# EAGLE design Un_RF_old (EAGLE 6.2)
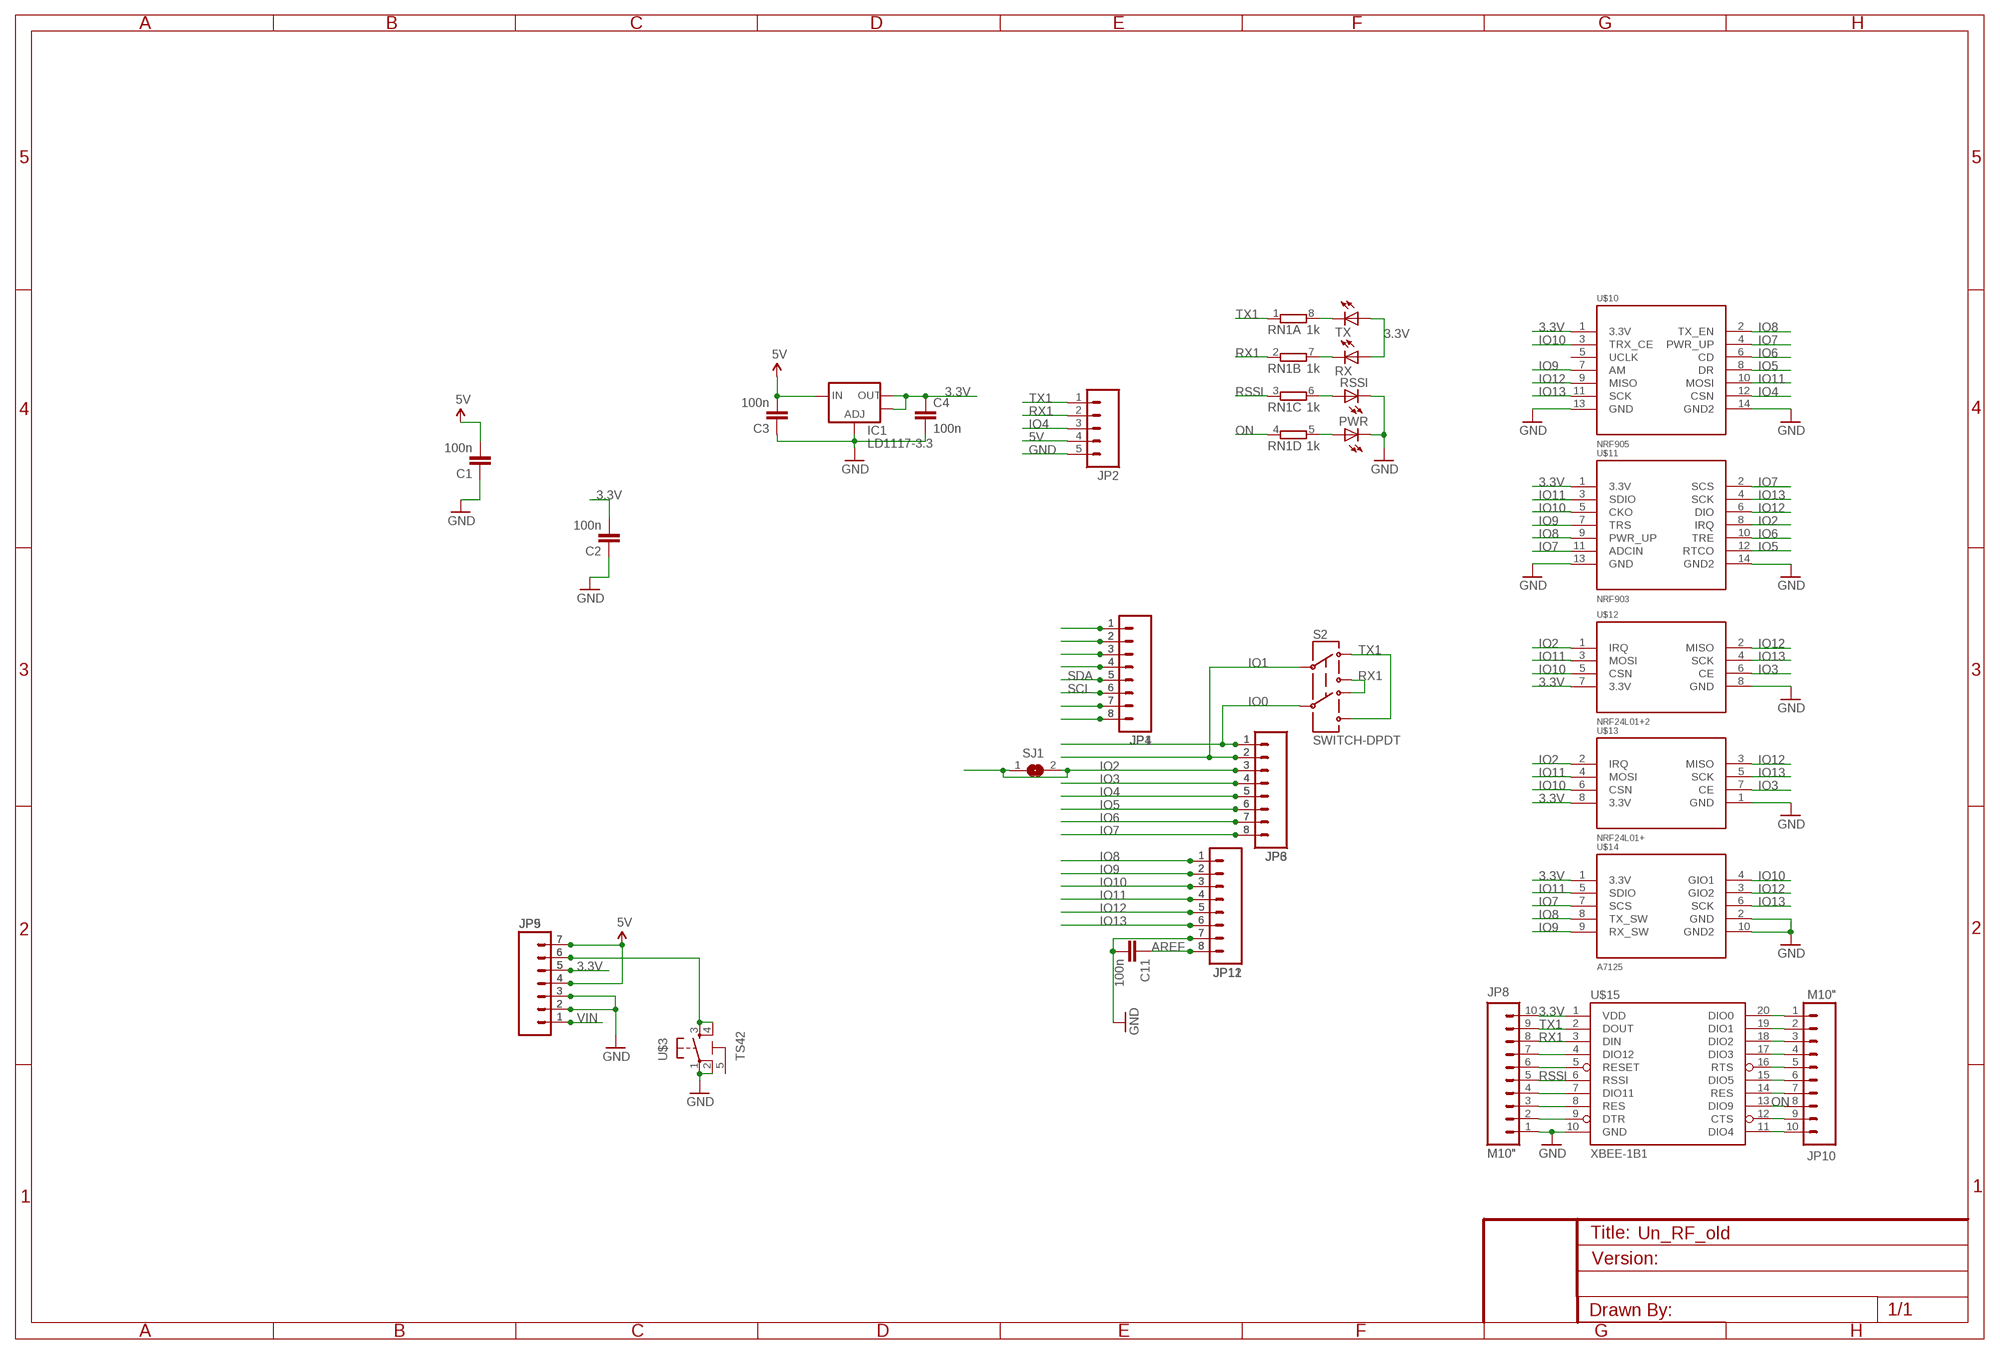
[diagram p0: schematic, sheet 1]

## Parts
C1  100n  CAP0603-CAP  [0603-CAP]
C2  100n  CAP0603-CAP  [0603-CAP]
C3  100n  CAP0603-CAP  [0603-CAP]
C4  100n  CAP0603-CAP  [0603-CAP]
C11  100n  CAP0603-CAP  [0603-CAP]
IC1  LD1117-3.3  V_REG_LM1117SOT223  [SOT223]
JP1  M081X08  [1X08]
JP2  M05PTH  [1X05]
JP3  M08  [1X08]
JP4  M081X08  [1X08]
JP5  M07  [1X07]
JP6  M08  [1X08]
JP8  M10"  [1X10]
JP9  M07  [1X07]
JP10  M10"  [1X10]
JP11  M081X08  [1X08]
JP12  M081X08  [1X08]
PWR  LED0805  [LED-0805]
RN1  1k  4R-NCAY16  [CAY16]
RSSI  LED0805  [LED-0805]
RX  LED0805  [LED-0805]
S2  SWITCH-DPDT  [SWITCH-P2]
SJ1  SJ  [SJ]
TX  LED0805  [LED-0805]
U$3  TS42  [TS42]
U$10  NRF905  [2X7]
U$11  NRF903  [2X7]
U$12  NRF24L01+2  [2X4]
U$13  NRF24L01+  [1X08]
U$14  A7125  [1X10-2MM]
U$15  XBEE-1B1  [XBEE-1]

## Nets
3.3V: C2.2 C4.1 IC1.2(OUT) IC1.4(OUT) JP5.5 JP8.10 JP9.5 RX.1(A) TX.1(A) U$10.1(3.3V) U$11.1(3.3V) U$12.7(3.3V) U$13.8(3.3V) U$14.1(3.3V) U$15.1(VDD)
5V: C1.2 C3.2 IC1.3(IN) JP2.4 JP5.4 JP5.7 JP9.4 JP9.7
A0: JP1.1 JP4.1
AREF: C11.1 JP11.8 JP12.8
GND: C1.1 C2.1 C3.1 C4.2 C11.2 IC1.1(ADJ) JP2.5 JP5.2 JP5.3 JP8.1 JP9.2 JP9.3 JP11.7 JP12.7 PWR.2(C) RSSI.2(C) U$3.1 U$3.2 U$10.13(GND) U$10.14(GND2) U$11.13(GND) U$11.14(GND2) U$12.8(GND) U$13.1(GND) U$14.2(GND) U$14.10(GND2) U$15.10(GND)
IO0: JP3.1 JP6.1 S2.5
IO1: JP3.2 JP6.2 S2.2
IO2: JP3.3 JP6.3 SJ1.1 SJ1.2 U$11.8(IRQ) U$12.1(IRQ) U$13.2(IRQ)
IO3: JP3.4 JP6.4 U$12.6(CE) U$13.7(CE)
IO4: JP2.3 JP3.5 JP6.5 U$10.12(CSN)
IO5: JP3.6 JP6.6 U$10.8(DR) U$11.12(RTCO)
IO6: JP3.7 JP6.7 U$10.6(CD) U$11.10(TRE)
IO7: JP3.8 JP6.8 U$10.4(PWR_UP) U$11.2(SCS) U$11.11(ADCIN) U$14.7(SCS)
IO8: JP11.1 JP12.1 U$10.2(TX_EN) U$11.9(PWR_UP) U$14.8(TX_SW)
IO9: JP11.2 JP12.2 U$10.7(AM) U$11.7(TRS) U$14.9(RX_SW)
IO10: JP11.3 JP12.3 U$10.3(TRX_CE) U$11.5(CKO) U$12.5(CSN) U$13.6(CSN) U$14.4(GIO1)
IO11: JP11.4 JP12.4 U$10.10(MOSI) U$11.3(SDIO) U$12.3(MOSI) U$13.4(MOSI) U$14.5(SDIO)
IO12: JP11.5 JP12.5 U$10.9(MISO) U$11.6(DIO) U$12.2(MISO) U$13.3(MISO) U$14.3(GIO2)
IO13: JP11.6 JP12.6 U$10.11(SCK) U$11.4(SCK) U$12.4(SCK) U$13.5(SCK) U$14.6(SCK)
N$3: RN1.8 TX.2(C)
N$4: RN1.7 RX.2(C)
N$5: RN1.6 RSSI.1(A)
N$6: PWR.1(A) RN1.5
N$11: JP10.1 U$15.20(DIO0)
N$12: JP1.7 JP4.7
N$13: JP1.8 JP4.8
N$21: JP10.2 U$15.19(DIO1)
N$22: JP10.3 U$15.18(DIO2)
N$30: JP10.4 U$15.17(DIO3)
N$31: JP1.2 JP4.2
N$32: JP1.3 JP4.3
N$33: JP1.4 JP4.4
N$35: JP10.5 U$15.16(RTS)
N$36: JP10.6 U$15.15(DIO5)
N$37: JP10.7 U$15.14(RES)
N$38: JP5.6 JP9.6 U$3.3 U$3.4
N$42: JP10.9 U$15.12(CTS)
N$43: JP10.10 U$15.11(DIO4)
N$45: JP8.2 U$15.9(DTR)
N$46: JP8.3 U$15.8(RES)
N$47: JP8.4 U$15.7(DIO11)
N$49: JP8.6 U$15.5(RESET)
N$50: JP8.7 U$15.4(DIO12)
ON: JP10.8 RN1.4 U$15.13(DIO9)
RSSI: JP8.5 RN1.3 U$15.6(RSSI)
RX1: JP2.2 JP8.8 RN1.2 S2.3 S2.4 U$15.3(DIN)
SCL: JP1.6 JP4.6
SDA: JP1.5 JP4.5
TX1: JP2.1 JP8.9 RN1.1 S2.1 S2.6 U$15.2(DOUT)
VIN: JP5.1 JP9.1
Unconnected: U$3.5 U$10.5(UCLK)

## Library data of the parts
C1-C4 C11 = 1SparkFun:CAP: Capacitor Standard 0603 ceramic capacitor, and 0.1" leaded capacitor.
IC1 = 2SparkFun:V_REG_LM1117: Voltage Regulator LM1117 Standard adjustable voltage regulator but in SMD form. Spark Fun Electronics SKU : COM-00595
JP1 JP4 JP11 JP12 = 2SparkFun:M08: Header 8 Standard 8-pin 0.1" header. Use with straight break away headers (SKU : PRT-00116), right angle break away headers (PRT-00553), swiss pins (PRT-00743), machine pins (PRT-00117), and female headers (PRT-00115).
JP2 = 2SparkFun:M05: Header 5 Standard 5-pin 0.1" header. Use with straight break away headers (SKU : PRT-00116), right angle break away headers (PRT-00553), swiss pins (PRT-00743), machine pins (PRT-00117), and female headers (PRT-00115). Molex polarized connector foot print use with SKU : PRT-08230 with associated crimp pins and housings.
JP3 JP6 = 1SparkFun:M08: Header 8 Standard 8-pin 0.1" header. Use with straight break away headers (SKU : PRT-00116), right angle break away headers (PRT-00553), swiss pins (PRT-00743), machine pins (PRT-00117), and female headers (PRT-00115).
JP5 JP9 = 2SparkFun:M07: Header 7 Standard 7-pin 0.1" header. Use with straight break away headers (SKU : PRT-00116), right angle break away headers (PRT-00553), swiss pins (PRT-00743), machine pins (PRT-00117), and female headers (PRT-00115). NOTES ON THE VARIANTS LOCK and LOCK_LONGPADS... This footprint was designed to help hold the alignment of a through-hole component (i.e. 7-pin header) while soldering it into place. You may notice that each hole has been shifted either up or down by 0.005 of an inch from it's more standard position (which is usually a perfectly straight line). This slight alteration caused the pins (the squares in the middle) to touch the edges of the holes. Because they are alternating, it causes a "brace" to hold the header in place. 0.005 has proven to be the perfect amount of "off-center" position when using our standard breakaway headers. Although looks a little odd when you look at the bare footprint, once you have a header in there, the alteration is very hard to notice. Also, if you push a header all the way into place, it is covered up entirely on the bottom side. This idea of altering the position of holes to aid alignment will be further integrated into the Sparkfun Library for other footprints. It can help hold any component with 3 or more connection pins.
JP8 JP10 = 2SparkFun:M10: Header 10 Standard 10-pin 0.1" header. Use with straight break away headers (SKU : PRT-00116), right angle break away headers (PRT-00553), swiss pins (PRT-00743), machine pins (PRT-00117), and female headers (PRT-00115).
PWR RSSI RX TX = 1SparkFun:LED: LEDs Standard schematic elements and footprints for 5mm, 3mm, 1206, and 0603 sized LEDs. 5mm - Spark Fun Electronics SKU : COM-00529 (and others)
RN1 = resistor-dil:4R-N: Array Chip Resistor Source: RS Component / Phycomp; OC_FARNELL: unknown; OC_NEWARK: unknown
S2 = 2SparkFun:SWITCH-DPDT: DPDT Version of the COM-00597
SJ1 = jumper:SJ: SMD solder JUMPER
U$3 = 2SparkFun:TS42
U$10 = 2SparkFun:NRF905
U$11 = 2SparkFun:NRF903
U$12 U$13 = 2SparkFun:NRF24L01+
U$14 = 2SparkFun:A7125
U$15 = 2SparkFun:XBEE-1

## Net classes
0 default: width 0.254 mm, clearance 0.508 mm
1 power: width 0.61 mm, drill 0.61 mm, clearance 0.254 mm
2 gnd: width 0.305 mm, drill 0.559 mm, clearance 0.254 mm
3 usbvcc: width 0.508 mm, drill 0.61 mm, clearance 0.254 mm
4 aref: width 0.406 mm, drill 0.61 mm, clearance 0.254 mm

## Board
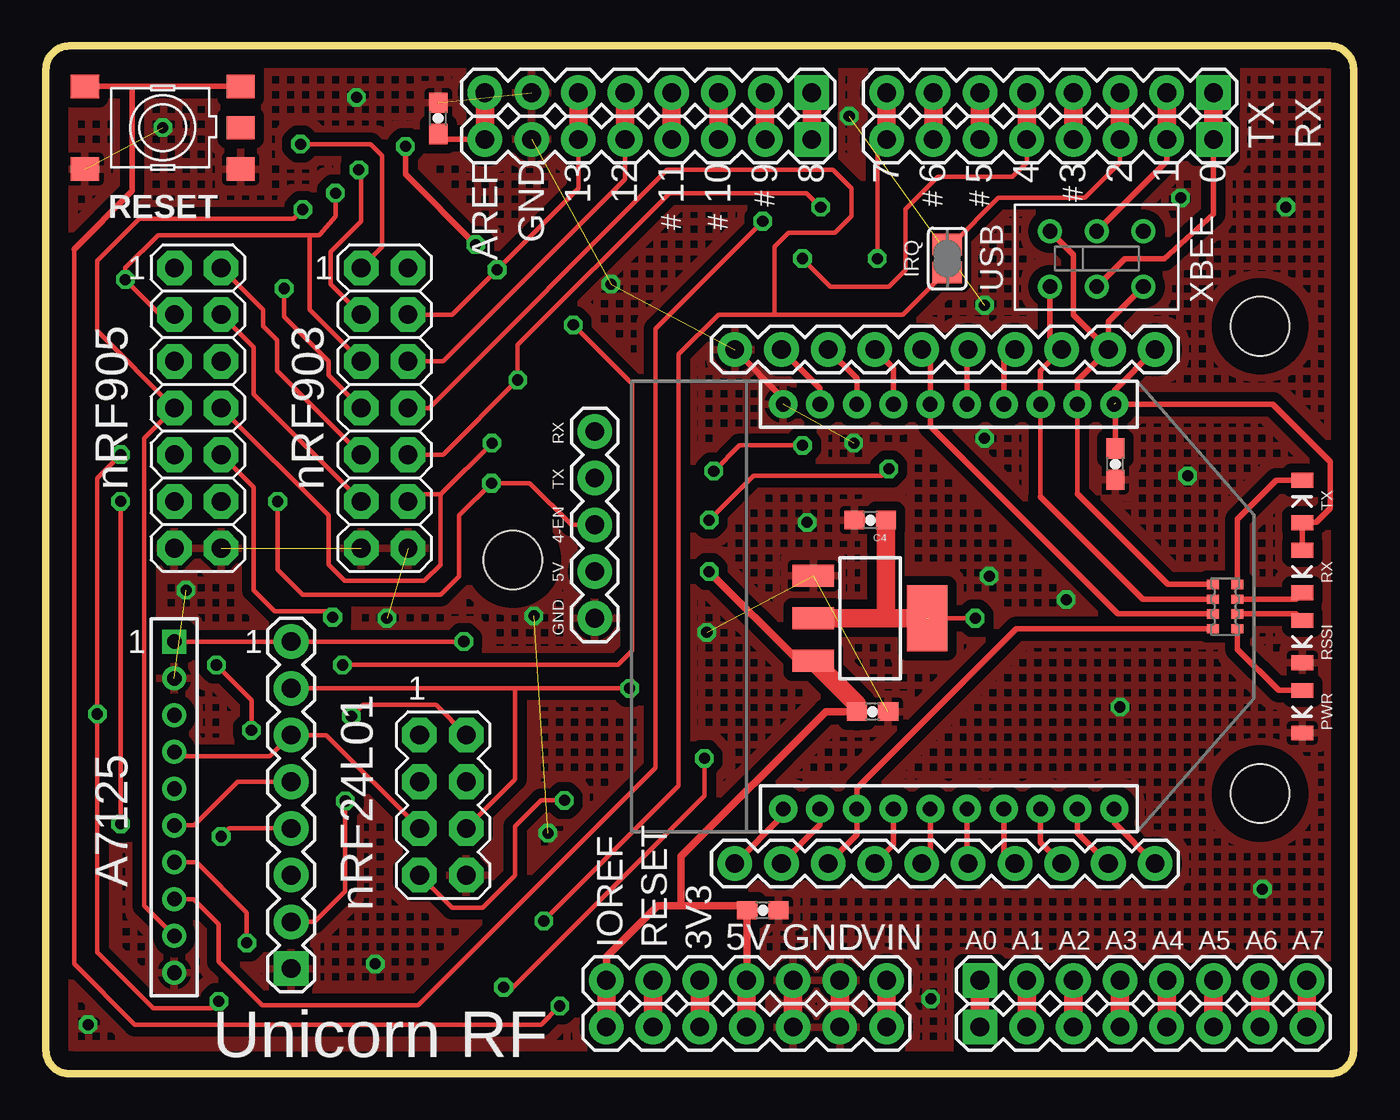
[diagram p1: board, top side]
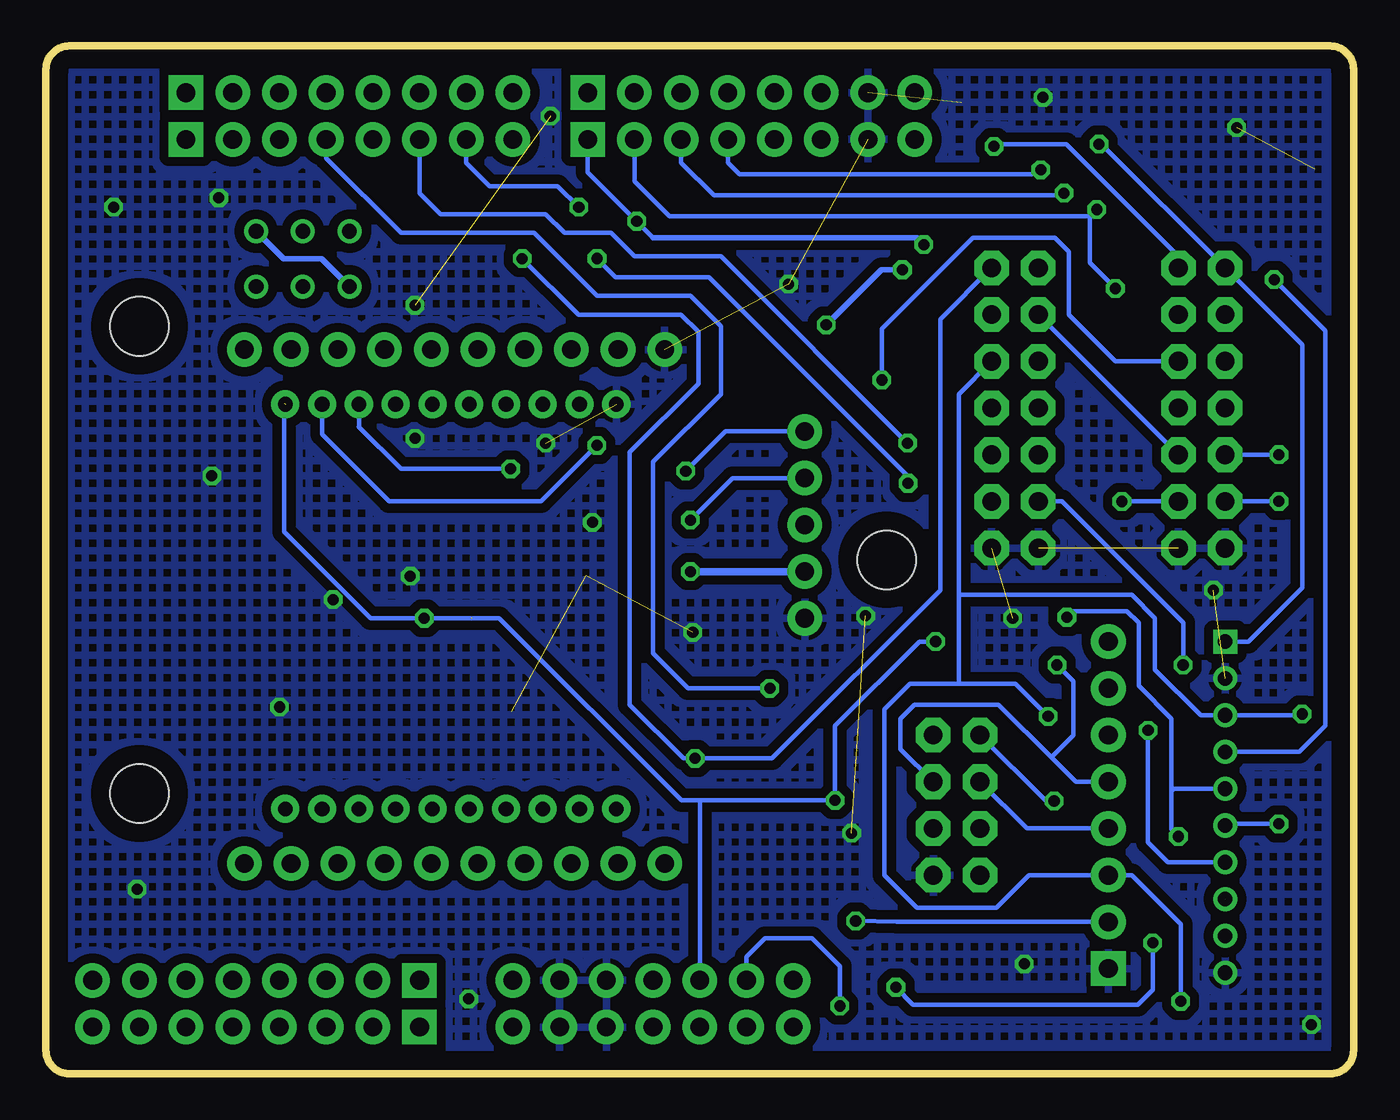
[diagram p2: board, bottom side, seen from below]

Size 71.12 x 55.88 mm. Coordinates in mm from the lower left corner, seen from the top.
Outline: 1.27,0 69.85,0 arc90 71.12,1.27 71.12,54.61 arc90 69.85,55.88 1.27,55.88 arc90 0,54.61 0,1.27 arc90 1.27,0
Copper layers (1*16): Top 0.035mm / dielectric 1.5mm / Bottom 0.035mm
Design rules: minimum track width 10mil, minimum drill 24mil, track to track 10mil, track to pad 10mil, pad to pad 10mil, via to via 10mil, smd to smd 10mil, copper to edge 40mil, drill to drill 10mil, minimum pad ring 10mil, minimum via ring 8mil, stop-mask expansion 4mil, vias tented up to drill 0mil, thermal gap 10mil
Holes 3.2 mm at 66.04,40.64 66.04,15.24 25.4,27.94

### Footprints (pad centres in the part's own frame; a part is rotated, then mirrored left to right if it is on the bottom)
0603-CAP = smd 1.1 x 1: 1 -0.85,0; 2 0.85,0
SOT223 = smd 1.219 x 2.235: 1 -2.311,-3.099; 2 0,-3.099; 3 2.311,-3.099 | smd 3.6 x 2.2: 4 0,3.099
1X08 = drill 1.016 pad 1.88 square: 1 0,0 | drill 1.016 pad 1.88: 2 2.54,0; 3 5.08,0; 4 7.62,0; 5 10.16,0; 6 12.7,0; 7 15.24,0; 8 17.78,0
1X05 = drill 1.016 pad 1.88: 1 0,0; 2 2.54,0; 3 5.08,0; 4 7.62,0; 5 10.16,0
1X07 = drill 1.016 pad 1.88: 1 0,0; 2 2.54,0; 3 5.08,0; 4 7.62,0; 5 10.16,0; 6 12.7,0; 7 15.24,0
1X10 = drill 1.016 pad 1.88: 1 0,0; 2 2.54,0; 3 5.08,0; 4 7.62,0; 5 10.16,0; 6 12.7,0; 7 15.24,0; 8 17.78,0; 9 20.32,0; 10 22.86,0
LED-0805 = smd 0.8 x 1.2: 1 -1.154,0; 2 1.154,0
CAY16 = smd 0.5 x 0.65: 1 -1.2,-0.675; 2 -0.4,-0.675; 3 0.4,-0.675; 4 1.2,-0.675; 5 1.2,0.675; 6 0.4,0.675; 7 -0.4,0.675; 8 -1.2,0.675
SWITCH-P2 = drill 0.8: 1 0,3.01; 2 2.54,3.01; 3 5.08,3.01; 4 0,0; 5 2.54,0; 6 5.08,0
SJ = smd 1.168 x 1.6: 1 -0.762,0; 2 0.762,0
TS42 = smd 1.524 x 1.27: 1 -4.229,2.25; 2 4.229,2.25; 3 -4.229,-2.25; 4 4.229,-2.25; 5 -4.229,-0.002
2X7 = drill 1.016 pad 1.88 octagon: 1 0,0; 2 0,2.54; 3 2.54,0; 4 2.54,2.54; 5 5.08,0; 6 5.08,2.54; 7 7.62,0; 8 7.62,2.54; 9 10.16,0; 10 10.16,2.54; 11 12.7,0; 12 12.7,2.54; 13 15.24,0; 14 15.24,2.54
2X4 = drill 1.016 pad 1.88 octagon: 1 -3.81,-1.27; 2 -3.81,1.27; 3 -1.27,-1.27; 4 -1.27,1.27; 5 1.27,-1.27; 6 1.27,1.27; 7 3.81,-1.27; 8 3.81,1.27
1X10-2MM = drill 0.8 square: 1 0,0 | drill 0.8: 2 2,0; 3 4,0; 4 6,0; 5 8,0; 6 10,0; 7 12,0; 8 14,0; 9 16,0; 10 18,0
XBEE-1 = drill 0.8 pad 1.524: 1 -11,20; 2 -11,18; 3 -11,16; 4 -11,14; 5 -11,12; 6 -11,10; 7 -11,8; 8 -11,6; 9 -11,4; 10 -11,2; 11 11,2; 12 11,4; 13 11,6; 14 11,8; 15 11,10; 16 11,12; 17 11,14; 18 11,16; 19 11,18; 20 11,20

### Placement (x,y rotation side)
C1  38.99,8.89 180 top
C2  58.17,33.15 90 top
C3  44.96,19.68 180 top
C4  44.83,30.1 180 top
C11  21.34,51.94 90 top
IC1  44.83,24.77 270 top
JP1  50.8,5.08 0 top
JP2  29.84,34.92 270 top
JP3  63.5,53.34 180 top
JP4  50.8,2.54 0 top
JP5  45.72,2.54 180 top
JP6  63.5,50.8 180 top
JP8  37.47,39.37 0 top
JP9  45.72,5.08 180 top
JP10  60.33,11.43 180 top
JP11  41.66,50.8 180 top
JP12  41.66,53.34 180 top
PWR  68.33,19.68 270 top
RN1  64.14,25.4 270 top
RSSI  68.33,23.5 270 top
RX  68.33,27.3 270 top
S2  54.61,42.8 0 top
SJ1  49.02,44.32 270 top
TX  68.33,31.11 90 top
U$3  6.35,51.44 180 top
U$10  6.98,43.81 270 top
U$11  17.14,43.81 270 top
U$12  21.59,14.61 270 top
U$13  13.33,5.71 90 top
U$14  6.98,23.5 270 top
U$15  38.1,25.4 270 top

### Tracks (layer width: path | path; a pad name or v marks a point on that pad's centre or on a via)
3.3V  (via drill 0.6, 0.61)  (2 unrouted)
  Top 0.254: U$14.1 U$13.8 v22.73,23.5 | U$11.1 18.29,44.96 18.29,49.91 17.65,50.55 v13.84,50.55 | U$12.7 22.1,9.02 23.75,9.02 25.53,10.79 25.53,13.46 26.92,14.86 v28.19,14.86 | v50.55,24.77 48.01,24.77
  Top 0.305: U$15.1 58.1,37.15 JP8.10 | U$15.1 66.72,36.4 69.85,33.27 69.85,30.73 69.09,29.97 68.34,29.97 TX.1 | TX.1 68.7,29.96 | TX.1 RX.1 | C2.2 58.17,36.33 U$15.1
  Top 1.016: JP5.5 JP9.5 | IC1.2 45.97,24.77 | 45.97,24.77 IC1.4 | C4.1 45.68,25.06 45.97,24.77
  Bottom 0.254: U$15.1 | v22.73,23.5 23.62,23.5 28.19,18.92 v28.19,14.86 35.56,14.86 | v13.84,50.55 13.72,50.55 U$10.1 2.79,39.62 2.79,27.56 2.79,27.3 2.79,26.42 5.72,23.5 U$14.1 | 35.56,14.86 36.56,14.86 46.47,24.77 v50.55,24.77 53.47,24.77 58.17,29.46 58.17,36.45 | JP9.5 35.56,14.86
5V  (via drill 0.6)
  Top 0.254: JP9.4 38.14,5.12 | 37.82,9.14 38.02,8.94 C1.2 37.89,9.14
  Top 0.406: v36.07,27.3 40.92,22.45 IC1.3 | C3.2 42.42,19.68 34.54,11.81 34.54,9.14 | JP9.7 30.48,6.35 33.27,9.14 34.54,9.14 | 38.14,5.12 C1.2 | 37.82,9.14 34.54,9.14
  Top 1.016: JP5.7 JP9.7 | JP5.4 JP9.4 | C3.2 44.11,20.08 IC1.3
  Bottom 0.406: JP2.4 v36.07,27.3
A0
  Top 1.016: JP1.1 JP4.1
AREF
  Top 0.305: JP11.8 21.63,50.8 C11.1
  Top 1.016: JP12.8 JP11.8
GND  (via drill 0.6)  (12 unrouted)
  Top 0.254: 68.33,22.35 RSSI.2
  Top 0.305: U$15.10 40.1,36.73 JP8.1
  Top 1.016: JP5.2 JP9.2 | JP5.3 JP9.3
  other vias: 6.35,51.44 16.89,53.09 51.05,41.78 51.05,34.54 55.5,25.78 51.31,27.05 62.1,32.51 58.42,19.94 66.17,10.03 17.91,5.97 48.13,4.06 26.54,24.89 18.54,24.77 67.44,47.12 7.62,26.29 2.29,2.67 30.73,42.93 35.94,24 43.69,52.07 27.31,13.08 43.94,34.29 41.4,29.97 61.72,47.62
  pour Bottom (hatched): 0,55.88 71.12,55.88 71.12,0 0,0
  pour Top (hatched): 0,55.88 71.12,55.88 71.12,0 0,0
IO0
  Top 0.305: S2.5 58.67,44.32 60.83,44.32 63.5,46.74 JP6.1
  Top 1.016: JP3.1 JP6.1
IO1
  Top 0.305: JP6.2 60.96,49.62 S2.2
  Top 1.016: JP3.2 JP6.2
IO2  (via drill 0.61)
  Top 0.254: v16.28,14.83 16.28,9.93 14.61,8.26 U$13.2 | v27.08,8.31 34.42,15.65 34.42,39.12 36.58,41.27 39.62,41.27 | JP6.3 58.42,49.53 56.52,47.62 51.82,47.62 49.28,45.09 SJ1.1 SJ1.2 48.89,43.56 46.61,41.27 39.62,41.27 | 39.62,41.27 39.62,44.96 40.39,45.72 42.93,45.72 43.81,46.61 43.81,48.13 42.8,49.15 33.78,49.15 20.83,36.2 U$11.8
  Top 1.016: JP3.3 JP6.3
  Bottom 0.254: U$13.2 24.87,8.26 v27.08,8.31 | U$12.1 16.74,14.83 v16.28,14.83
IO3  (via drill 0.6)
  Top 0.254: U$13.7 25.53,20.95 | 25.53,20.95 v31.75,20.95 | U$12.6 25.53,16 25.53,20.95
  Top 1.016: JP3.4 JP6.4
  Bottom 0.254: JP6.4 55.88,49.78 51.82,45.72 44.58,45.72 41.15,42.29 36.07,42.29 34.42,40.64 34.42,36.96 38.1,33.27 38.1,22.86 36.19,20.95 v31.75,20.95
IO4  (via drill 0.61)
  Top 0.254: v12.6,31.11 12.6,27.41 13.97,26.04 21.46,26.04 22.48,27.05 22.48,30.35 v24.23,32.11 26.31,32.11 28.58,29.84 JP2.3 | v41.15,44.32 42.67,42.8 45.85,42.8 46.74,43.69 46.74,46.99 48.51,48.77 52.58,48.77 53.34,49.53 JP6.5
  Top 1.016: JP3.5 JP6.5
  Bottom 0.254: v12.6,31.11 U$10.12 | v24.23,32.11 24.23,32.49 35.05,43.31 40.13,43.31 v41.15,44.32
IO5  (via drill 0.6)
  Top 0.254: U$10.8 15.37,30.35 15.37,27.69 16.26,26.8 20.57,26.8 21.46,27.69 21.46,31.5 | 21.46,31.5 v24.26,34.29 | U$11.12 20.07,31.5 21.46,31.5
  Top 1.016: JP3.6 JP6.6
  Bottom 0.254: JP6.6 50.8,47.88 49.66,46.74 43.94,46.74 42.93,45.72 40.39,45.72 39.12,44.45 34.42,44.45 v24.26,34.29
IO6  (via drill 0.6, 0.61)
  Top 0.254: v42.14,47.12 41.38,47.88 34.42,47.88 34.29,47.88 33.91,47.88 25.65,39.62 v25.65,37.72 21.59,33.66 U$11.10
  Top 1.016: JP3.7 JP6.7
  Bottom 0.254: U$10.6 12.95,38.73 15.49,41.27 15.49,44.7 16.26,45.47 20.7,45.47 25.65,40.51 v25.65,37.72 | JP6.7 48.26,49.53 46.99,48.26 43.28,48.26 v42.14,47.12
IO7  (via drill 0.6, 0.61)
  Top 0.254: U$10.4 11.3,39.5 11.3,36.96 U$11.11 | U$14.7 8.19,11.49 10.92,8.76 v10.92,7.11 | v11.18,18.67 11.18,20.32 v9.27,22.23 | v24.89,4.7 25.4,4.7 35.81,15.11 v35.81,17.14 | JP6.8 45.21,50.29 v45.21,44.32
  Top 1.016: JP3.8 JP6.8
  Bottom 0.254: U$14.7 10.11,11.51 11.18,12.57 v11.18,18.67 | v10.92,7.11 10.92,4.57 11.73,3.76 23.95,3.76 v24.89,4.7 | v9.27,22.23 9.27,24.51 15.88,31.11 U$11.11 | U$11.2 22.48,41.02 22.48,26.29 31.62,17.14 v35.81,17.14 36.45,17.14 39.37,20.07 39.37,33.78 35.64,37.52 35.64,40.34 36.58,41.27 42.16,41.27 v45.21,44.32
IO8  (via drill 0.6, 0.61)  (1 unrouted)
  Top 0.254: v38.99,46.35 33.15,40.51 33.15,16.64 20.24,3.73 11.76,3.73 9.4,6.1 9.4,8.13 8.03,9.5 U$14.8 | U$11.9 12.57,38.23 12.57,39.88 11.81,40.64 11.81,41.53 U$10.2
  Top 0.305: v19.56,50.42 19.56,48.9 v23.37,45.09
  Top 1.016: JP12.1 JP11.1
  Bottom 0.254: JP11.1 41.66,49.02 v38.99,46.35 38.1,45.47 | U$10.2 9.53,44.45 15.62,50.55 19.43,50.55 v19.56,50.42
  Bottom 0.305: 38.1,45.47 23.75,45.47 v23.37,45.09
IO9  (via drill 0.6, 0.61)
  Top 0.254: v12.95,42.7 12.95,41.15 15.37,38.73 15.37,37.97 U$11.7 | U$14.9 5.33,9.15 5.33,34.54 U$10.7 2.79,40.39 2.79,44.2 5.08,46.48 13.46,46.48 v13.97,46.99
  Top 1.016: JP11.2 JP12.2
  Bottom 0.254: JP11.2 39.12,48.51 37.21,46.61 14.35,46.61 | 14.35,46.61 v13.97,46.99 | v12.95,42.7 14.35,44.09 14.35,46.61
IO10  (via drill 0.6)
  Top 0.254: U$12.5 15.24,18.41 U$13.6 13.23,18.34 12.17,17.27 7.21,17.27 U$14.4 | U$11.5 14.35,41.53 14.35,45.59 | 14.86,45.59 14.91,45.66 | 14.91,45.66 15.75,46.61 v15.75,47.88 | 14.35,45.59 6.1,45.59 4.32,43.81 v4.32,43.18 6.22,41.27 U$10.3 | 14.35,45.59 14.85,45.59 14.91,45.66
  Top 1.016: JP12.3 JP11.3
  Bottom 0.254: JP11.3 36.58,49.53 34.8,47.75 15.88,47.75 v15.75,47.88 | U$14.4 2.95,17.5 1.52,18.92 1.52,40.39 v4.32,43.18
IO11  (via drill 0.6, 0.61)
  Top 0.254: U$13.4 9.96,13.34 v9.53,12.9 | U$10.10 11.3,31.88 11.3,26.29 12.45,25.15 15.27,25.15 v15.6,24.82 | U$11.3 15.49,42.93 15.49,44.7 17.14,46.35 17.14,49.02 v17.02,49.15
  Top 1.016: JP11.4 JP12.4
  Bottom 0.254: U$11.3 U$10.10 | U$14.5 9.78,15.49 9.91,15.37 | U$13.4 17.78,13.34 U$12.3 | 9.91,15.37 9.91,19.3 11.68,21.08 11.68,24.51 12.32,25.15 15.27,25.15 v15.6,24.82 | 9.91,15.37 9.91,13.28 v9.53,12.9 | JP11.4 34.04,49.53 33.4,48.9 17.53,48.9 v17.02,49.15
IO12  (via drill 0.6, 0.61)
  Top 0.254: U$12.2 21.21,20.07 17.25,20.07 v16.61,19.43 | v4.06,33.66 2.79,32.38 v2.79,19.56 2.79,6.6 5.84,3.56 9.02,3.56 v9.4,3.94 | JP11.5 31.5,48.64 21.59,38.73 U$11.6
  Top 1.016: JP12.5 JP11.5
  Bottom 0.254: v9.4,3.94 9.4,8.13 12.06,10.79 U$13.3 17.65,10.79 19.43,9.02 23.75,9.02 25.53,10.79 25.53,19.81 24.13,21.21 21.46,21.21 | 21.46,21.21 18.39,21.21 v16.61,19.43 | U$11.6 21.46,36.96 21.46,26.04 | 21.46,26.04 21.46,21.21 | 21.46,26.04 12.06,26.04 10.8,24.77 10.8,21.97 8.32,19.5 U$14.3 2.86,19.5 v2.79,19.56 | U$10.9 v4.06,33.66
IO13  (via drill 0.6, 0.61)
  Top 0.254: v16.13,22.23 31.11,22.23 31.88,22.99 31.88,37.52 v28.68,40.72 | U$13.5 10.41,15.88 8.05,13.51 6.98,13.51 U$14.6 | v4.06,31.11 v4.06,13.59 | JP11.6 28.96,48.13 v24.54,43.71 22.1,41.27 U$11.4
  Top 1.016: JP11.6 JP12.6
  Bottom 0.254: U$13.5 15.11,15.88 16.38,17.14 | 16.38,17.14 19.3,20.07 23.88,20.07 24.64,19.3 24.64,17.65 U$12.4 | v16.13,22.23 15.24,21.34 15.24,18.41 16.38,17.27 16.38,17.14 | U$10.11 v4.06,31.11 | v4.06,13.59 6.89,13.59 U$14.6
  Bottom 0.305: v24.54,43.71 25.68,43.71 v28.68,40.72
N$3
  Top 0.305: 67.96,32.27 TX.2 68.31,32.26 66.93,32.26 64.81,30.14 RN1.8
N$4
  Top 0.305: RN1.7 67.97,25.8 RX.2
N$5
  Top 0.305: RN1.6 67.97,25 RSSI.1
N$6
  Top 0.305: PWR.1 67.04,20.84 64.81,23.07 RN1.5
N$11
  Top 0.305: U$15.20 58.1,13.65 JP10.1
N$12
  Top 1.016: JP1.7 JP4.7
N$13
  Top 1.016: JP1.8 JP4.8
N$21
  Top 0.305: U$15.19 56.1,13.12 JP10.2
N$22
  Top 0.305: U$15.18 54.1,12.57 JP10.3
N$30
  Top 0.305: U$15.17 52.1,12.04 JP10.4
N$31
  Top 1.016: JP4.2 JP1.2
N$32
  Top 1.016: JP1.3 JP4.3
N$33
  Top 1.016: JP4.4 JP1.4
N$35
  Top 0.305: U$15.16 50.1,11.49 JP10.5
N$36
  Top 0.305: U$15.15 48.1,11.9 JP10.6
N$37
  Top 0.305: U$15.14 46.1,12.45 JP10.7
N$38  (via drill 0.6)
  Top 0.254: 1.52,44.83 1.52,5.97 4.83,2.67 26.92,2.67 v27.94,3.68
  Top 0.305: U$3.4 4.7,53.69 | 4.7,53.69 U$3.3 | 1.52,44.83 4.7,48.01 4.7,53.69
  Top 1.016: JP5.6 JP9.6
  Bottom 0.254: v27.94,3.68 27.94,5.84 29.46,7.37 32,7.37 33.02,6.35 JP9.6
N$42
  Top 0.305: U$15.12 42.1,13.53 JP10.9
N$43
  Top 0.305: U$15.11 40.1,14.06 JP10.10
N$45
  Top 0.305: U$15.9 42.1,37.27 JP8.2
N$46
  Top 0.305: U$15.8 44.1,37.81 JP8.3
N$47
  Top 0.305: U$15.7 46.1,38.35 JP8.4
N$49
  Top 0.305: U$15.5 50.1,39.3 JP8.6
N$50
  Top 0.305: U$15.4 52.1,38.77 JP8.7
ON
  Top 0.305: JP10.8 44.1,12.98 U$15.13 44.1,15.53 52.78,24.2 RN1.4
RSSI
  Top 0.305: JP8.5 48.1,38.9 U$15.6 48.1,35.21 58.31,25 RN1.3
RX1  (via drill 0.6)
  Top 0.254: 54.1,31.37 U$15.3 | v36.07,30.1 38.48,32.51 45.47,32.51 v45.85,32.89
  Top 0.305: U$15.3 54.1,38.23 JP8.8 54.61,40.01 S2.4 | RN1.2 59.67,25.8 54.1,31.37
  Bottom 0.254: JP2.2 33.78,32.38 v36.07,30.1 | v45.85,32.89 51.82,32.89 54.1,35.18 U$15.3
  Bottom 0.305: S2.3 58.2,44.32 56.13,44.32 S2.4
SCL
  Top 1.016: JP1.6 JP4.6
SDA
  Top 1.016: JP1.5 JP4.5
TX1  (via drill 0.6)
  Top 0.254: v36.32,32.77 37.72,34.16 v41.15,34.16 | 56.1,31.53 U$15.2
  Top 0.305: U$15.2 56.1,37.69 JP8.9 | S2.1 55.88,44.54 55.88,41.27 JP8.9 | JP8.9 57.78,40.89 S2.6 | 56.1,31.53 61.03,26.6 RN1.1
  Bottom 0.254: JP2.1 34.16,34.92 v36.32,32.77 | U$15.2 56.1,34.76 52.45,31.11 44.2,31.11 v41.15,34.16
VIN
  Top 1.016: JP5.1 JP9.1

### Text on the board
tPlace: 13 | 12 | 11 | 10 | 9 | 8 | 7 | 6 | 5 | 4 | 3 | 2 | 1 | 0 | 1 | 1 | IRQ | USB | XBEE | RX | TX | nRF905 | nRF903 | 4-EN | TX | 5V | RX | GND | 1 | 1 | RSSI | 1 | PWR | A7125 | nRF24L01 | Unicorn RF
tNames: AREF | GND | TX | RX | RESET | # | # | # | # | # | # | IOREF | RESET | 3V3 | 5V | GND | VIN | A0 | A1 | A2 | A3 | A4 | A5 | A6 | A7